# EAGLE design 8x8-MotorState (EAGLE 9.6.2)
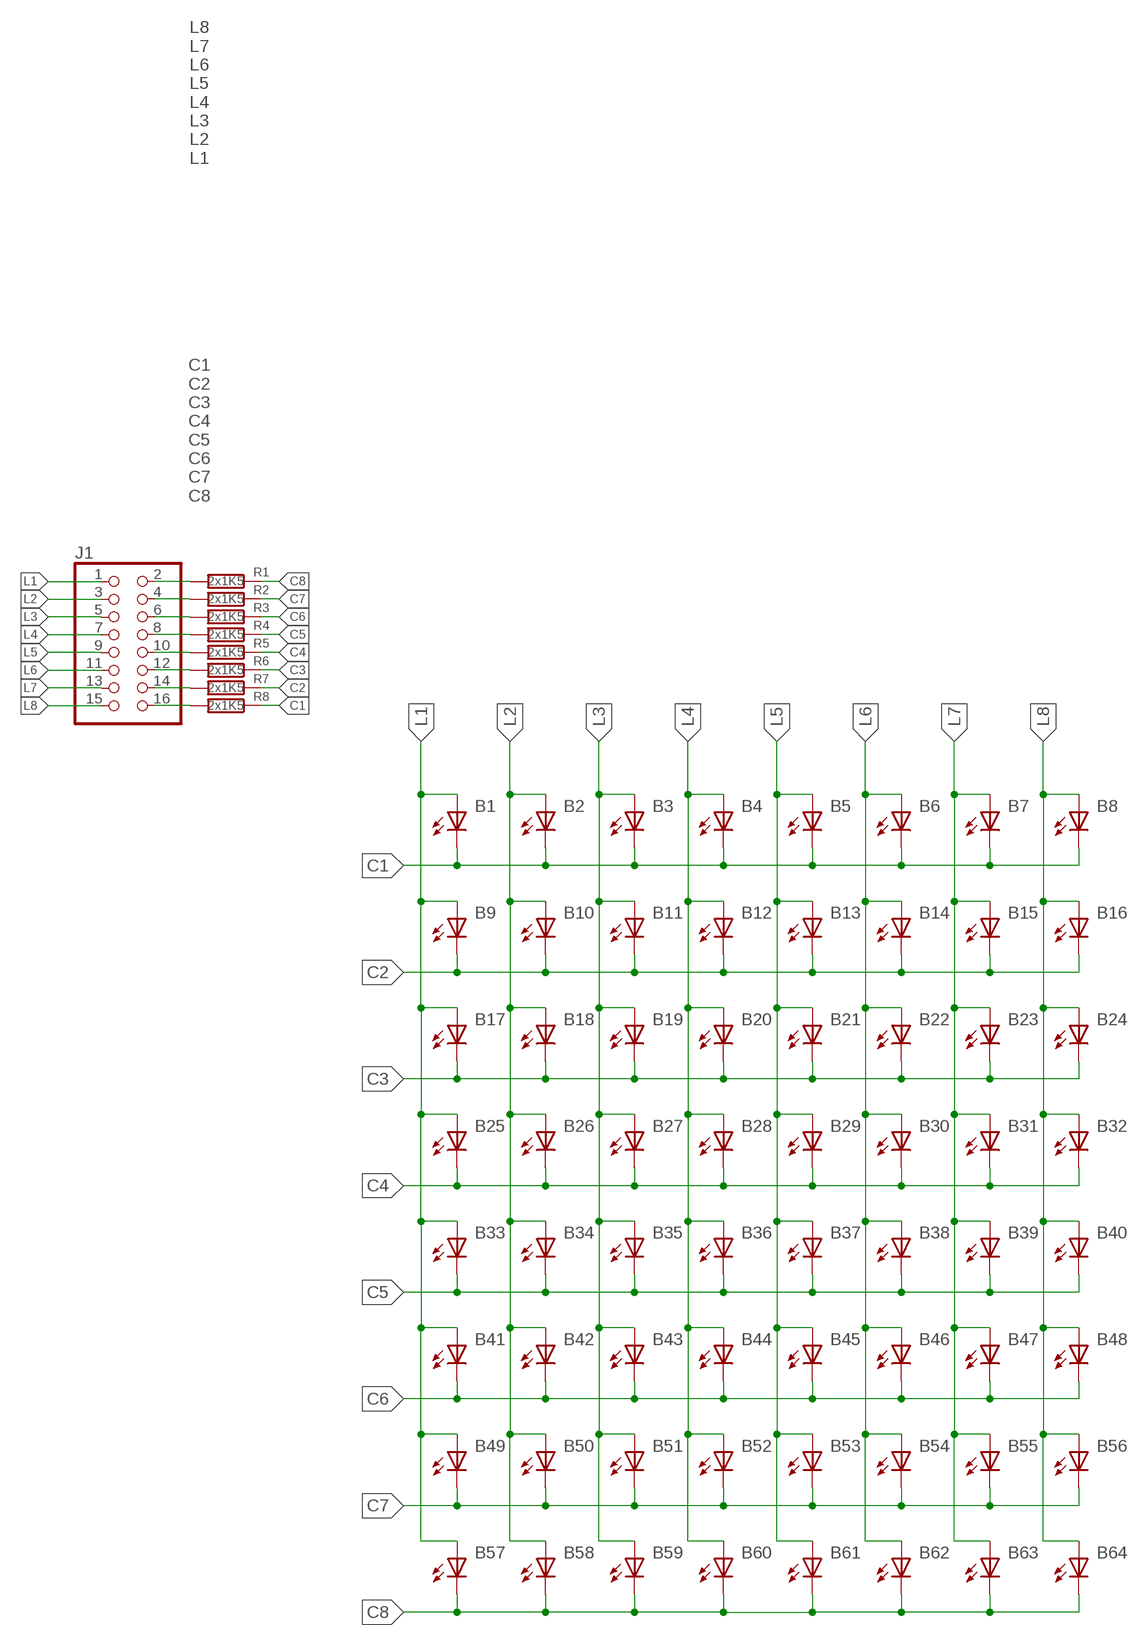
[diagram p0: schematic, sheet 1]

## Parts
B1  LED2835  [LED2835]
B2  LED2835  [LED2835]
B3  LED2835  [LED2835]
B4  LED2835  [LED2835]
B5  LED2835  [LED2835]
B6  LED2835  [LED2835]
B7  LED2835  [LED2835]
B8  LED2835  [LED2835]
B9  LED2835  [LED2835]
B10  LED2835  [LED2835]
B11  LED2835  [LED2835]
B12  LED2835  [LED2835]
B13  LED2835  [LED2835]
B14  LED2835  [LED2835]
B15  LED2835  [LED2835]
B16  LED2835  [LED2835]
B17  LED2835  [LED2835]
B18  LED2835  [LED2835]
B19  LED2835  [LED2835]
B20  LED2835  [LED2835]
B21  LED2835  [LED2835]
B22  LED2835  [LED2835]
B23  LED2835  [LED2835]
B24  LED2835  [LED2835]
B25  LED2835  [LED2835]
B26  LED2835  [LED2835]
B27  LED2835  [LED2835]
B28  LED2835  [LED2835]
B29  LED2835  [LED2835]
B30  LED2835  [LED2835]
B31  LED2835  [LED2835]
B32  LED2835  [LED2835]
B33  LED2835  [LED2835]
B34  LED2835  [LED2835]
B35  LED2835  [LED2835]
B36  LED2835  [LED2835]
B37  LED2835  [LED2835]
B38  LED2835  [LED2835]
B39  LED2835  [LED2835]
B40  LED2835  [LED2835]
B41  LED2835  [LED2835]
B42  LED2835  [LED2835]
B43  LED2835  [LED2835]
B44  LED2835  [LED2835]
B45  LED2835  [LED2835]
B46  LED2835  [LED2835]
B47  LED2835  [LED2835]
B48  LED2835  [LED2835]
B49  LED2835  [LED2835]
B50  LED2835  [LED2835]
B51  LED2835  [LED2835]
B52  LED2835  [LED2835]
B53  LED2835  [LED2835]
B54  LED2835  [LED2835]
B55  LED2835  [LED2835]
B56  LED2835  [LED2835]
B57  LED2835  [LED2835]
B58  LED2835  [LED2835]
B59  LED2835  [LED2835]
B60  LED2835  [LED2835]
B61  LED2835  [LED2835]
B62  LED2835  [LED2835]
B63  LED2835  [LED2835]
B64  LED2835  [LED2835]
J1  PINHEAD_2X8PTH  [PINHEAD-2X08]
R1  2x1K5  RESISTOR_1206  [R1206]
R2  2x1K5  RESISTOR_1206  [R1206]
R3  2x1K5  RESISTOR_1206  [R1206]
R4  2x1K5  RESISTOR_1206  [R1206]
R5  2x1K5  RESISTOR_1206  [R1206]
R6  2x1K5  RESISTOR_1206  [R1206]
R7  2x1K5  RESISTOR_1206  [R1206]
R8  2x1K5  RESISTOR_1206  [R1206]

## Nets
C1: B1.C B2.C B3.C B4.C B5.C B6.C B7.C B8.C R8.1
C2: B9.C B10.C B11.C B12.C B13.C B14.C B15.C B16.C R7.1
C3: B17.C B18.C B19.C B20.C B21.C B22.C B23.C B24.C R6.1
C4: B25.C B26.C B27.C B28.C B29.C B30.C B31.C B32.C R5.1
C5: B33.C B34.C B35.C B36.C B37.C B38.C B39.C B40.C R4.1
C6: B41.C B42.C B43.C B44.C B45.C B46.C B47.C B48.C R3.1
C7: B49.C B50.C B51.C B52.C B53.C B54.C B55.C B56.C R2.1
C8: B57.C B58.C B59.C B60.C B61.C B62.C B63.C B64.C R1.1
L1: B1.A B9.A B17.A B25.A B33.A B41.A B49.A B57.A J1.1
L2: B2.A B10.A B18.A B26.A B34.A B42.A B50.A B58.A J1.3
L3: B3.A B11.A B19.A B27.A B35.A B43.A B51.A B59.A J1.5
L4: B4.A B12.A B20.A B28.A B36.A B44.A B52.A B60.A J1.7
L5: B5.A B13.A B21.A B29.A B37.A B45.A B53.A B61.A J1.9
L6: B6.A B14.A B22.A B30.A B38.A B46.A B54.A B62.A J1.11
L7: B7.A B15.A B23.A B31.A B39.A B47.A B55.A B63.A J1.13
L8: B8.A B16.A B24.A B32.A B40.A B48.A B56.A B64.A J1.15
N$1: J1.2 R1.2
N$2: J1.4 R2.2
N$3: J1.6 R3.2
N$4: J1.8 R4.2
N$5: J1.10 R5.2
N$6: J1.12 R6.2
N$7: J1.14 R7.2
N$8: J1.16 R8.2

## Notes on the sheet
- L8
  L7
  L6
  L5
  L4
  L3
  L2
  L1
- C1
  C2
  C3
  C4
  C5
  C6
  C7
  C8

## Library data of the parts
B1-B64 = MyFavorite:LED
J1 = MYConnector:PINHEAD_2X8
R1-R8 = VM-MCU:RESISTOR_: RESISTOR, European symbol

## Board
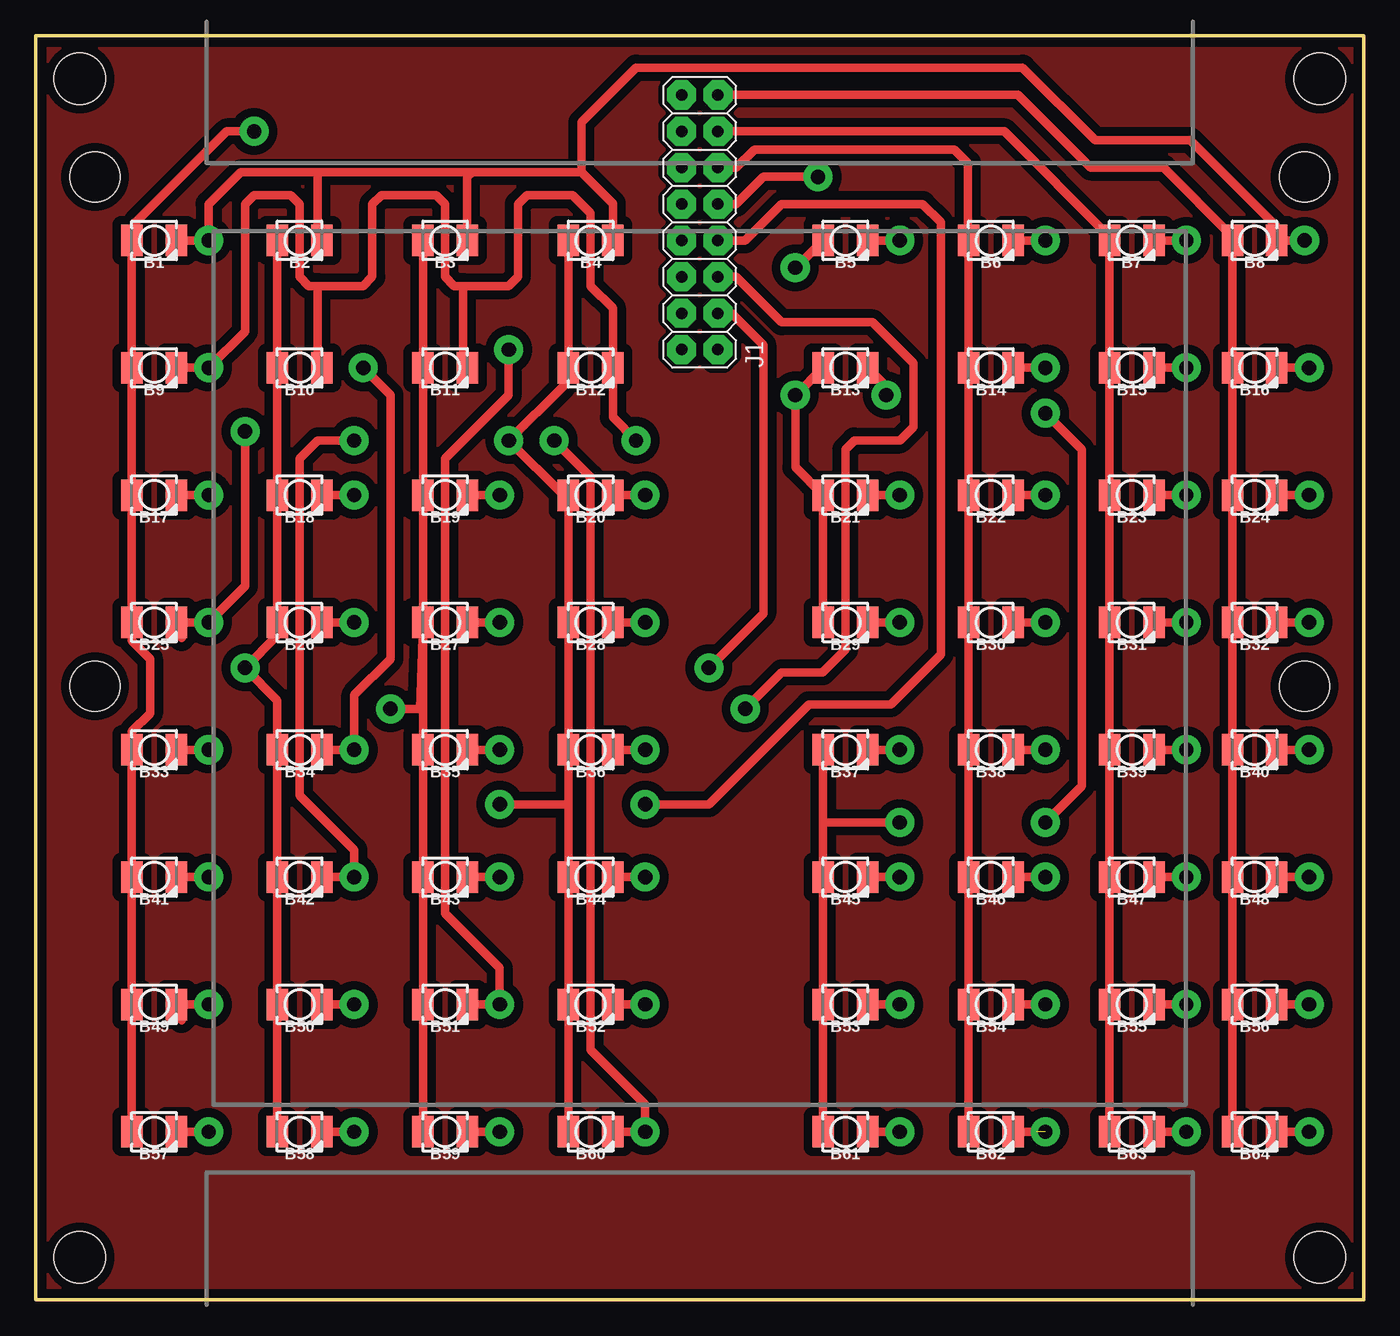
[diagram p1: board, top side]
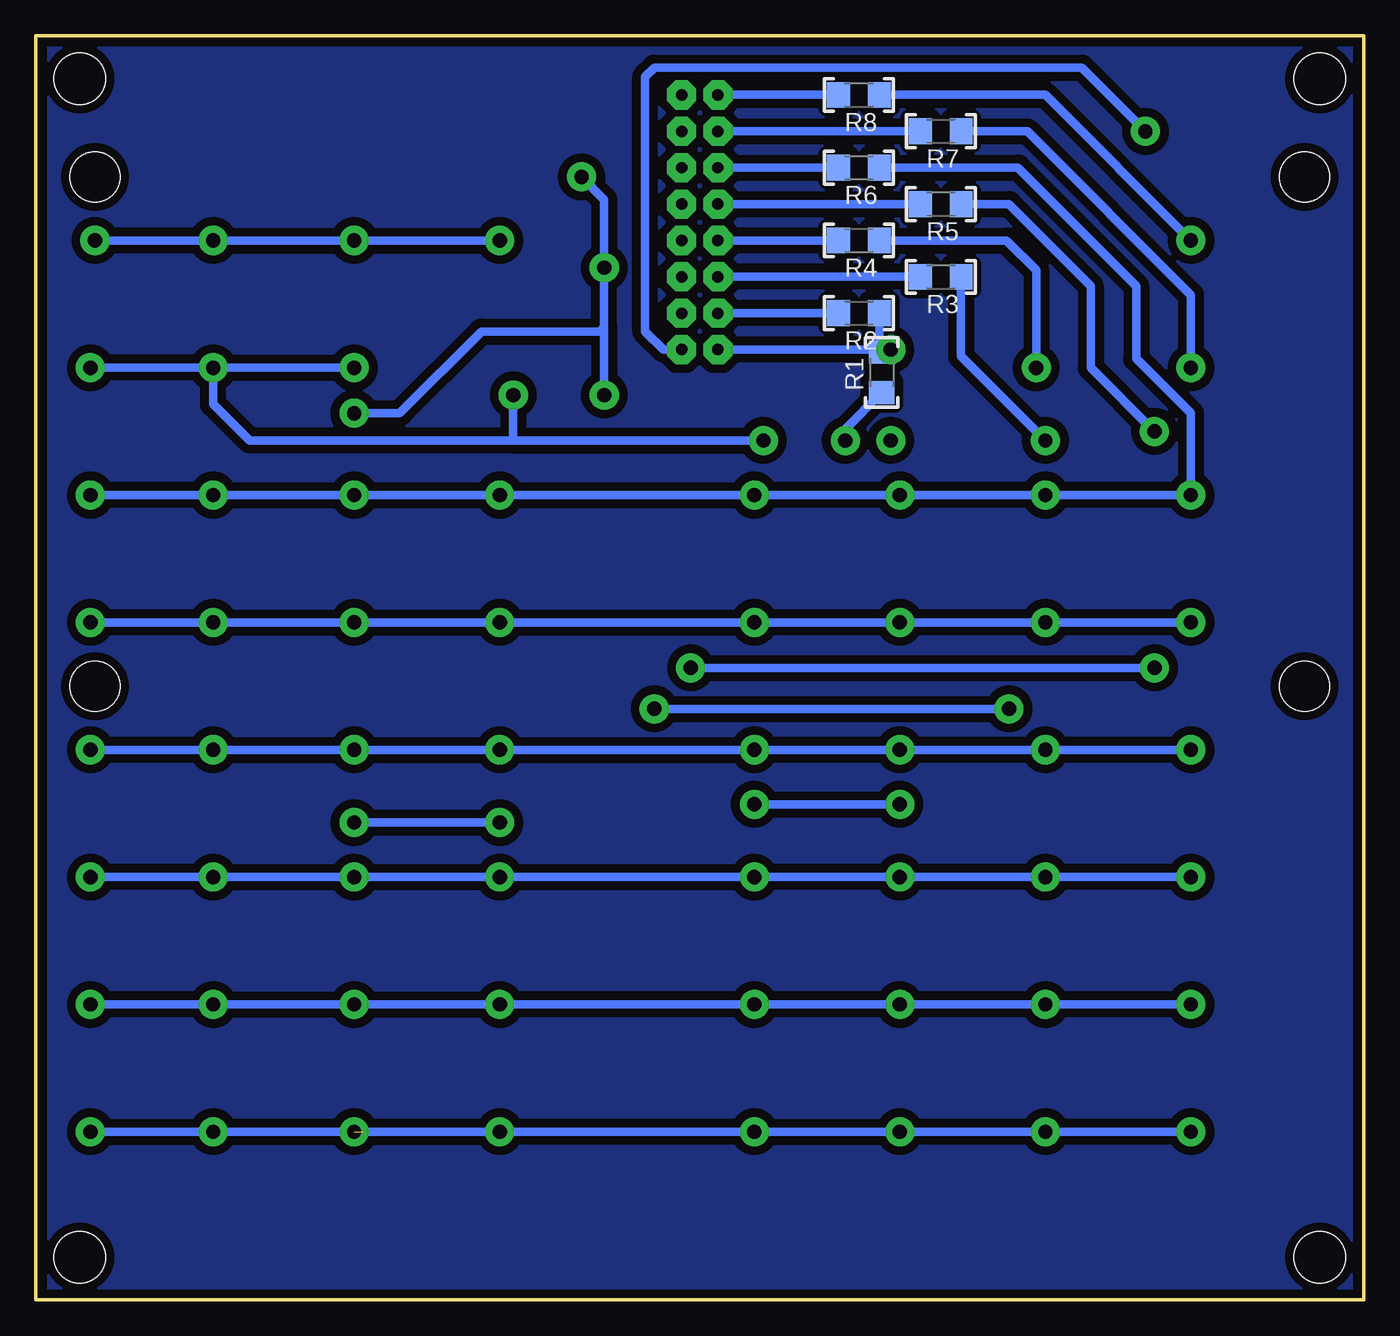
[diagram p2: board, bottom side, seen from below]

Size 92.71 x 88.27 mm. Coordinates in mm from the lower left corner, seen from the top.
Copper layers (1*16): Top 0.035mm / dielectric 1.5mm / Bottom 0.035mm
Design rules "default *": minimum track width 6mil, minimum drill 0.35mm, track to track 24mil, track to pad 6mil, pad to pad 6mil, via to via 6mil, smd to smd 0mil, copper to edge 24mil, drill to drill 6mil, minimum pad ring 10mil, minimum via ring 8mil, stop-mask expansion 4mil, vias tented up to drill 0mil, thermal gap 20mil
Holes 3.5 mm at 4.13,78.42 4.13,42.86 88.58,42.86 88.58,78.42

### Footprints (pad centres in the part's own frame; a part is rotated, then mirrored left to right if it is on the bottom)
LED2835 = smd 1.5 x 2.2: A -1.55,0; C 1.55,0
PINHEAD-2X08 = drill 0.8 pad 2.032 octagon: 1 0,0; 2 0,2.54; 3 2.54,0; 4 2.54,2.54; 5 5.08,0; 6 5.08,2.54; 7 7.62,0; 8 7.62,2.54; 9 10.16,0; 10 10.16,2.54; 11 12.7,0; 12 12.7,2.54; 13 15.24,0; 14 15.24,2.54; 15 17.78,0; 16 17.78,2.54
R1206 = smd 1.6 x 1.803: 1 -1.422,0; 2 1.422,0
BOX-PLC_115X90_V2 = hole 3.6: -43.276,41.15; 43.276,41.15; -43.276,-41.15; 43.276,-41.15

### Placement (x,y rotation side)
B1  8.25,73.98 0 top
B2  18.41,73.98 0 top
B3  28.57,73.98 0 top
B4  38.73,73.98 0 top
B5  56.52,73.98 0 top
B6  66.67,73.98 0 top
B7  76.52,73.98 0 top
B8  85.09,73.98 0 top
B9  8.25,65.09 0 top
B10  18.41,65.09 0 top
B11  28.57,65.09 0 top
B12  38.73,65.09 0 top
B13  56.52,65.09 0 top
B14  66.67,65.09 0 top
B15  76.52,65.09 0 top
B16  85.09,65.09 0 top
B17  8.25,56.2 0 top
B18  18.41,56.2 0 top
B19  28.57,56.2 0 top
B20  38.73,56.2 0 top
B21  56.52,56.2 0 top
B22  66.67,56.2 0 top
B23  76.52,56.2 0 top
B24  85.09,56.2 0 top
B25  8.25,47.31 0 top
B26  18.41,47.31 0 top
B27  28.57,47.31 0 top
B28  38.73,47.31 0 top
B29  56.52,47.31 0 top
B30  66.67,47.31 0 top
B31  76.52,47.31 0 top
B32  85.09,47.31 0 top
B33  8.25,38.42 0 top
B34  18.41,38.42 0 top
B35  28.57,38.42 0 top
B36  38.73,38.42 0 top
B37  56.52,38.42 0 top
B38  66.67,38.42 0 top
B39  76.52,38.42 0 top
B40  85.09,38.42 0 top
B41  8.25,29.53 0 top
B42  18.41,29.53 0 top
B43  28.57,29.53 0 top
B44  38.73,29.53 0 top
B45  56.52,29.53 0 top
B46  66.67,29.53 0 top
B47  76.52,29.53 0 top
B48  85.09,29.53 0 top
B49  8.25,20.64 0 top
B50  18.41,20.64 0 top
B51  28.57,20.64 0 top
B52  38.73,20.64 0 top
B53  56.52,20.64 0 top
B54  66.67,20.64 0 top
B55  76.52,20.64 0 top
B56  85.09,20.64 0 top
B57  8.25,11.75 0 top
B58  18.41,11.75 0 top
B59  28.57,11.75 0 top
B60  38.73,11.75 0 top
B61  56.52,11.75 0 top
B62  66.67,11.75 0 top
B63  76.52,11.75 0 top
B64  85.09,11.75 0 top
J1  47.62,66.36 90 top
R1  33.66,64.77 90 bottom
R2  35.24,68.9 180 bottom
R3  29.53,71.44 180 bottom
R4  35.24,73.98 180 bottom
R5  29.53,76.52 180 bottom
R6  35.24,79.06 180 bottom
R7  29.53,81.6 180 bottom
R8  35.24,84.14 180 bottom
U$1  [BOX-PLC_115X90_V2]  46.35,44.13 0 top

### Tracks (layer width: path | path; a pad name or v marks a point on that pad's centre or on a via)
C1  (via drill 1 pad 2.03)
  Top 0.61: B5.C v60.32,73.98 | v88.58,73.98 B8.C 86.64,74.93 80.61,80.96 73.98,80.96 68.9,86.04 41.91,86.04 38.1,82.23 38.1,78.74 | B6.C v70.48,73.98 | B7.C v80.33,73.98 | B4.C 40.28,76.55 38.1,78.74 | B1.C v12.06,73.98 12.06,76.52 14.29,78.74 19.68,78.74 | 38.1,78.74 30.48,78.74 | 30.48,78.74 19.68,78.74 | B2.C 19.68,74.26 19.68,78.74 | B3.C 30.12,78.38 30.48,78.74
  Bottom 0.61: v60.32,73.98 v70.48,73.98 v80.33,73.98 v88.58,73.98 | R8.1 22.22,84.14 v12.06,73.98
C2  (via drill 1 pad 2.03)
  Top 0.61: B14.C v70.48,65.09 | B15.C v80.33,65.09 | B16.C v88.9,65.09 | v41.91,60.01 40.28,61.63 B12.C 40.28,69.25 38.73,70.8 38.73,75.88 37.46,77.15 34.29,77.15 33.66,76.52 33.66,71.44 33.02,70.8 29.84,70.8 | B9.C v12.06,65.09 14.6,67.63 14.6,76.52 15.24,77.15 17.78,77.15 18.41,76.52 18.41,71.44 19.05,70.8 19.68,70.8 | 19.68,70.8 22.86,70.8 23.49,71.44 23.49,76.52 24.13,77.15 27.94,77.15 28.57,76.52 28.57,71.44 29.21,70.8 29.84,70.8 | B10.C 19.68,65.37 19.68,70.8 | B11.C 29.84,65.37 29.84,70.8 | v59.37,63.18 59.37,63.78 B13.C
  Bottom 0.61: 59.37,60.01 77.79,60.01 80.33,62.55 v80.33,65.09 | v80.33,65.09 v70.48,65.09 | v80.33,65.09 v88.9,65.09 | v59.37,63.18 59.37,60.01 | 59.37,60.01 v41.91,60.01 | R7.1 23.49,81.6 12.06,70.17 v12.06,65.09
C3  (via drill 1 pad 2.03)
  Top 0.61: B21.C v60.32,56.2 | B22.C v70.48,56.2 | B23.C v80.33,56.2 | B24.C v88.9,56.2 | v42.54,56.2 B20.C | B19.C v32.38,56.2 | B18.C v22.22,56.2 | B17.C v12.06,56.2
  Bottom 0.61: v88.9,56.2 v80.33,56.2 v70.48,56.2 v60.32,56.2 v42.54,56.2 v32.38,56.2 v22.22,56.2 v12.06,56.2 12.06,61.91 15.87,65.72 15.87,70.8 24.13,79.06 R6.1
C4  (via drill 1 pad 2.03)
  Top 0.61: 10.17,46.2 B25.C v12.06,47.31 14.6,49.85 v14.6,60.64 | B28.C v42.54,47.31 | B29.C v60.32,47.31 | B30.C v70.48,47.31 | B31.C v80.33,47.31 | B32.C v88.9,47.31 | B27.C v32.38,47.31 | B26.C v22.22,47.31
  Bottom 0.61: v12.06,47.31 v22.22,47.31 v32.38,47.31 v42.54,47.31 v60.32,47.31 v70.48,47.31 v80.33,47.31 v88.9,47.31 | R5.1 24.76,76.52 19.05,70.8 19.05,65.09 v14.6,60.64
C5  (via drill 1 pad 2.03)
  Top 0.61: B34.C v22.22,38.42 22.22,42.23 24.76,44.77 24.76,63.18 v22.86,65.09 | B35.C v32.38,38.42 | B36.C v42.54,38.42 | B37.C v60.32,38.42 | B38.C v70.48,38.42 | B39.C v80.33,38.42 | B40.C v88.9,38.42 | B33.C v12.06,38.42
  Bottom 0.61: v12.06,38.42 v22.22,38.42 v32.38,38.42 v42.54,38.42 v60.32,38.42 v70.48,38.42 v80.33,38.42 v88.9,38.42 | R4.1 24.93,73.98 22.86,71.91 v22.86,65.09
C6  (via drill 1 pad 2.03)
  Top 0.61: B42.C v22.22,29.53 22.22,31.43 18.41,35.24 18.41,58.74 19.68,60.01 v22.22,60.01 | B43.C v32.38,29.53 | v42.54,29.53 B44.C | B47.C v80.33,29.53 | B48.C v88.9,29.53 | B46.C v70.48,29.53 | B45.C v60.32,29.53 | v12.06,29.53 B41.C
  Bottom 0.61: v12.06,29.53 v22.22,29.53 v32.38,29.53 v42.54,29.53 v60.32,29.53 v70.48,29.53 v80.33,29.53 v88.9,29.53 | R3.1 28.1,65.89 v22.22,60.01
C7  (via drill 1 pad 2.03)
  Top 0.61: 10.17,19.53 B49.C v12.06,20.64 | B50.C v22.22,20.64 | B51.C v32.38,20.64 32.38,23.18 28.57,26.99 28.57,58.74 33.02,63.18 v33.02,66.36 | v42.54,20.64 B52.C | B53.C v60.32,20.64 | B56.C v88.9,20.64 | B54.C v70.48,20.64 | B55.C v80.33,20.64
  Bottom 0.61: v12.06,20.64 v22.22,20.64 v32.38,20.64 v42.54,20.64 v60.32,20.64 v70.48,20.64 v80.33,20.64 v88.9,20.64 | R2.1 33.82,67.16 v33.02,66.36
C8  (via drill 1 pad 2.03)  (1 unrouted)
  Top 0.61: B58.C v22.22,11.75 | B59.C v32.38,11.75 | B60.C v42.54,11.75 42.54,13.65 38.73,17.46 38.73,57.47 v36.19,60.01 | B61.C v60.32,11.75 | B62.C v70.48,11.75 | B63.C v80.33,11.75 | B64.C v88.9,11.75 | B57.C v12.06,11.75
  Bottom 0.61: v12.06,11.75 v22.22,11.75 v32.38,11.75 v42.54,11.75 v60.32,11.75 | v60.32,11.75 79.69,11.75 | v88.9,11.75 v80.33,11.75 v70.48,11.75 | 69.85,11.75 v60.32,11.75 | v36.19,60.01 36.19,60.81 R1.1
GND
  pour Top (isolate 0.61, rank 2): 0.63,87.63 92.07,87.63 92.07,0.63 0.63,0.63
  pour Bottom (isolate 0.61, rank 2): 0.63,87.63 92.07,87.63 92.07,0.63 0.63,0.63
L1  (via drill 1 pad 2.03)
  Top 0.61: B57.A B49.A B41.A B33.A 6.7,39.69 7.97,40.96 7.97,44.77 6.7,46.04 B25.A B17.A B9.A B1.A 6.98,74.26 6.98,75.25 13.33,81.6 v15.24,81.6
  Bottom 0.61: v15.24,81.6 19.68,86.04 49.53,86.04 50.16,85.41 50.16,67.63 48.89,66.36 J1.1
L2  (via drill 1 pad 2.03)
  Top 0.61: B2.A B10.A B18.A B26.A 16.86,46.39 v14.6,44.13 16.86,41.87 B34.A B42.A B50.A B58.A | J1.3 48.58,68.9 50.8,66.68 50.8,47.94 v46.99,44.13
  Bottom 0.61: v46.99,44.13 v14.6,44.13
L3  (via drill 1 pad 2.03)
  Top 0.61: B27.A 26.84,41.28 v24.76,41.28 | B27.A B19.A B11.A B3.A | B27.A B35.A B43.A B51.A B59.A | J1.5 48.89,71.44 52.07,68.26 58.42,68.26 61.28,65.41 61.28,60.96 60.32,60.01 57.15,60.01 56.52,59.37 56.52,45.4 54.93,43.81 52.07,43.81 v49.53,41.28
  Bottom 0.61: v49.53,41.28 v24.76,41.28
L4  (via drill 1 pad 2.03)
  Top 0.61: J1.7 49.53,73.98 52.07,76.52 61.91,76.52 63.18,75.25 63.18,45.09 59.69,41.59 53.97,41.59 46.99,34.61 v42.54,34.61 | B60.A B52.A B44.A 37.18,34.61 | B4.A B12.A 36.83,63.82 v33.02,60.01 36.83,56.2 36.83,56.07 B20.A B28.A B36.A 37.18,34.61 | v32.38,34.61 37.18,34.61
  Bottom 0.61: v42.54,34.61 v32.38,34.61
L5  (via drill 1 pad 2.03)
  Top 0.61: B61.A B53.A B45.A 54.96,33.34 | B29.A B21.A 53.02,58.14 v53.02,63.18 53.06,63.18 B13.A | J1.9 48.89,76.52 50.8,78.42 v54.61,78.42 | v70.48,61.91 73.03,59.37 73.03,35.88 v70.48,33.34 | B37.A 54.96,33.34 | v60.32,33.34 54.96,33.34 | v53.02,72.07 53.06,72.07 B5.A
  Bottom 0.61: v70.48,33.34 v60.32,33.34 | 53.02,67.94 53.34,67.63 61.59,67.63 67.31,61.91 v70.48,61.91 | 53.02,67.94 v53.02,72.07 53.02,76.84 v54.61,78.42 | 53.02,67.94 v53.02,63.18
L6
  Top 0.61: J1.11 48.89,79.06 50.16,80.33 64.13,80.33 65.09,79.37 65.09,72.87 B6.A B14.A B22.A B30.A B38.A B46.A B54.A B62.A
L7
  Top 0.61: J1.13 67.63,81.6 74.97,74.26 B7.A B15.A B23.A B31.A B39.A B47.A B55.A B63.A
L8
  Top 0.61: J1.15 68.58,84.14 73.66,79.06 78.74,79.06 83.54,74.26 B8.A B16.A B24.A B32.A B40.A B48.A B56.A B64.A
N$1
  Bottom 0.61: R1.2 33.82,66.36 J1.2
N$2
  Bottom 0.61: R2.2 J1.4
N$3
  Bottom 0.61: R3.2 J1.6
N$4
  Bottom 0.61: R4.2 J1.8
N$5
  Bottom 0.61: J1.10 R5.2
N$6
  Bottom 0.61: J1.12 R6.2
N$7
  Bottom 0.61: J1.14 R7.2
N$8
  Bottom 0.61: J1.16 R8.2

### Text on the board
tValues: 00 | 01 | 02 | 03 | 04 | 05 | 06 | 07 | C8 C7 C6 C5 C4 C3 C2 C1 | L1 L2 L3 L4 L5 L6 L7 L8 | 10 | 11 | 12 | 13 | 14 | 15 | 16 | 17 | 20 | 21 | 22 | 23 | 24 | 25 | 26 | 27 | 30 | 31 | 32 | 33 | 34 | 35 | 36 | 37 | 40 | 41 | 42 | 43 | 44 | 45 | 46 | 47 | 50 | 51 | 52 | 53 | 54 | 55 | 56 | 57 | 60 | 61 | 62 | 63 | 64 | 65 | 66 | 67 | 70 | 71 | 72 | 73 | 74 | 75 | 76 | 77